# EAGLE design carte (EAGLE 7.2.0)
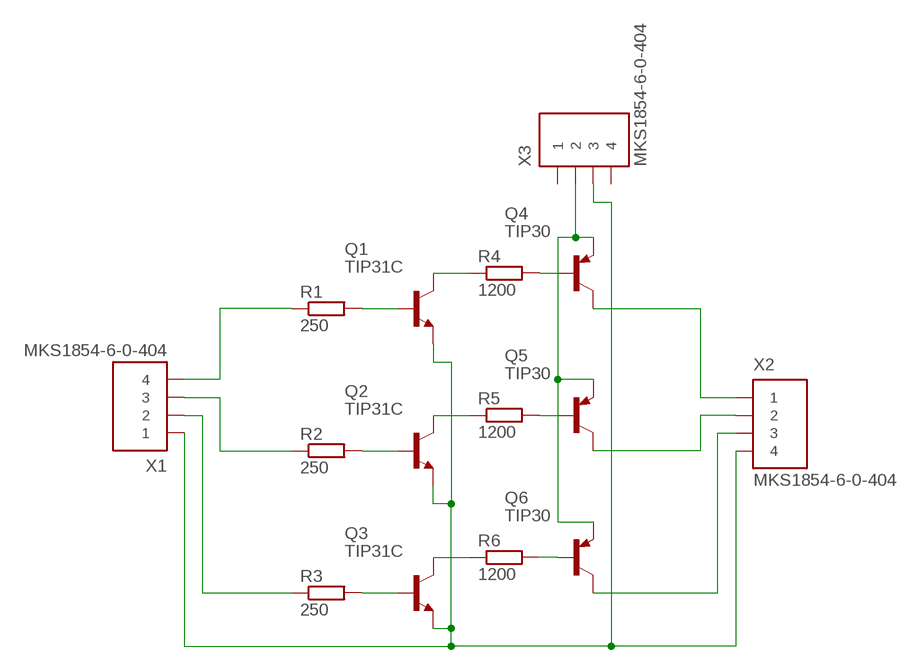
[diagram p0: schematic, sheet 1]

## Parts
Q1  TIP31C  [TO220]
Q2  TIP31C  [TO220]
Q3  TIP31C  [TO220]
Q4  TIP30  [TO220]
Q5  TIP30  [TO220]
Q6  TIP30  [TO220]
R1  250  R-EU_0207/10  [0207/10]
R2  250  R-EU_0207/10  [0207/10]
R3  250  R-EU_0207/10  [0207/10]
R4  1200  R-EU_0207/10  [0207/10]
R5  1200  R-EU_0207/10  [0207/10]
R6  1200  R-EU_0207/10  [0207/10]
X1  MKS1854-6-0-404  [MKS1854-6-0-404]
X2  MKS1854-6-0-404  [MKS1854-6-0-404]
X3  MKS1854-6-0-404  [MKS1854-6-0-404]

## Nets
N$1: Q1.1(B) R1.2
N$2: Q2.1(B) R2.2
N$3: Q3.1(B) R3.2
N$4: Q1.2(C) R4.1
N$5: Q2.2(C) R5.1
N$6: Q3.2(C) R6.1
N$7: Q4.1(B) R4.2
N$8: Q5.1(B) R5.2
N$9: Q6.1(B) R6.2
N$10: Q1.3(E) Q2.3(E) Q3.3(E) X1.1 X2.4 X3.3
N$12: R1.1 X1.4
N$13: R2.1 X1.3
N$14: R3.1 X1.2
N$15: Q4.3(E) Q5.3(E) Q6.3(E) X3.2
N$16: Q4.2(C) X2.1
N$17: Q5.2(C) X2.2
N$18: Q6.2(C) X2.3
Unconnected: X3.1 X3.4

## Library data of the parts
Q1-Q3 = transistor-npn:TIP31C*: NPN Transistor
Q4-Q6 = transistor-pnp:TIP30: PNP Transistor
R1-R6 = resistor:R-EU_: RESISTOR, European symbol
X1-X3 = con-stocko:MKS1854-6-0-404: Serie MKS 1850 Lötstifte In-line, Raster 2.5 mm, Stiftwannen, stehend, mit Rastlasche Source: http://www.stocko.de/de/index.php?seite=ka_rfk2_mks1850.html&rubrik=Katalog+-+RFK+2 rfk_1850.pdf; OC_FARNELL: 1141862; OC_NEWARK: unknown

## Net classes
0 default: width 0.025 mm

## Board
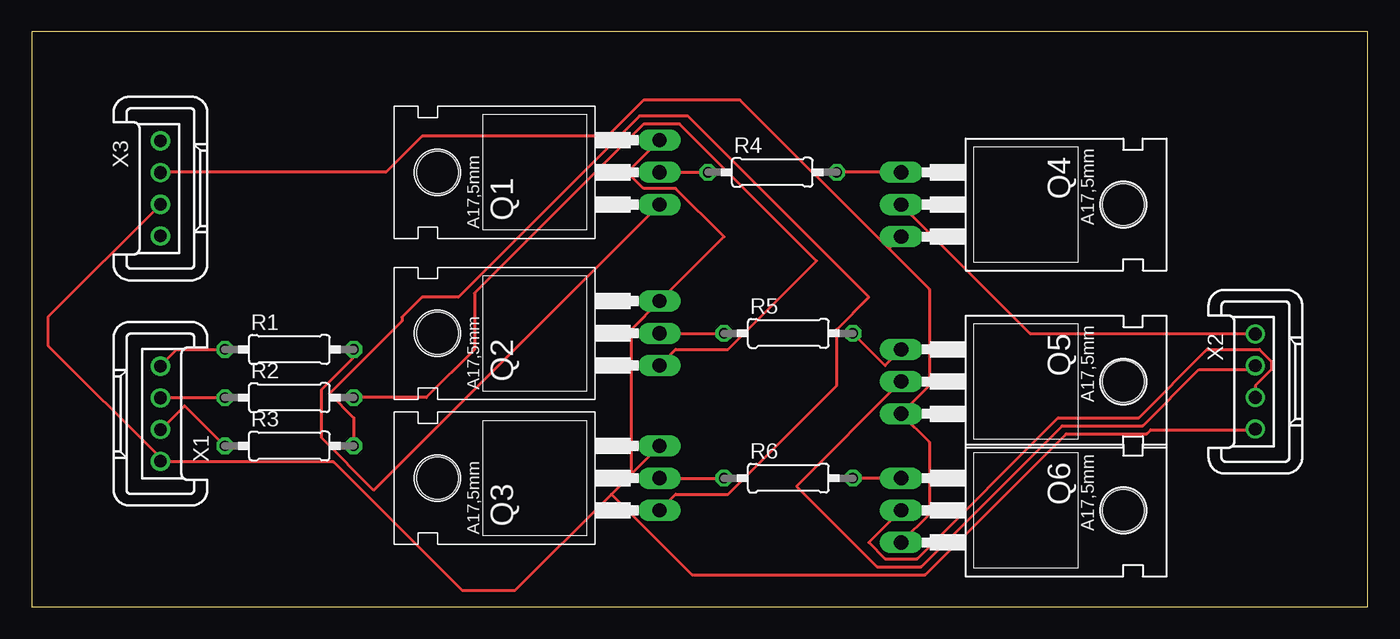
[diagram p1: board, top side]

Size 105.39 x 45.39 mm. Coordinates in mm from the lower left corner, seen from the top.
Outline: 0,0 105.39,0 105.39,45.39 0,45.39 0,0
Copper layers (1*16): Top 0.035mm / dielectric 1.5mm / Bottom 0.035mm
Design rules "default": minimum track width 10mil, minimum drill 24mil, track to track 8mil, track to pad 8mil, pad to pad 8mil, via to via 8mil, smd to smd 8mil, copper to edge 40mil, drill to drill 8mil, minimum pad ring 10mil, minimum via ring 8mil, stop-mask expansion 4mil, vias tented up to drill 0mil, thermal gap 10mil

### Footprints (pad centres in the part's own frame; a part is rotated, then mirrored left to right if it is on the bottom)
TO220 = drill 1.118 long: 1 -2.54,-6.35; 2 0,-6.35; 3 2.54,-6.35 | hole 3.302: 0,11.176
0207/10 = drill 0.813 octagon: 1 -5.08,0; 2 5.08,0
MKS1854-6-0-404 = drill 1 pad 1.422: 1 -3.75,0; 2 -1.25,0; 3 1.25,0; 4 3.75,0

### Placement (x,y rotation side)
Q1  43.18,34.29 90 top
Q2  43.18,21.59 90 top
Q3  43.18,10.16 90 top
Q4  74.93,31.75 270 top
Q5  74.93,17.78 270 top
Q6  74.93,7.62 270 top
R1  20.32,20.32 0 top
R2  20.32,16.51 0 top
R3  20.32,12.7 0 top
R4  58.42,34.29 0 top
R5  59.69,21.59 0 top
R6  59.69,10.16 0 top
X1  10.16,15.24 90 top
X2  96.52,17.78 270 top
X3  10.16,33.02 270 top

### Tracks (layer width: path | path; a pad name or v marks a point on that pad's centre or on a via)
N$1
  Top 0.254: R1.2 25.4,19.69 22.86,17.15 22.86,13.34 26.99,9.21 Q1.1
N$2
  Top 0.254: R2.2 31.11,16.51 34.92,20.32 34.92,24.77 48.26,38.1 51.12,38.1 61.91,27.3 54.93,20.32 50.8,20.32 Q2.1
N$3
  Top 0.254: R3.2 25.4,14.92 23.49,16.83 29.21,22.54 29.21,22.86 30.8,24.45 33.66,24.45 47.94,38.74 51.75,38.74 66.04,24.45 63.5,21.91 63.5,17.46 54.93,8.89 50.8,8.89 Q3.1
N$4
  Top 0.254: Q1.2 R4.1
N$5
  Top 0.254: Q2.2 R5.1
N$6
  Top 0.254: Q3.2 R6.1
N$7
  Top 0.254: Q4.1 R4.2
N$8
  Top 0.254: R5.2 67.31,19.05 Q5.1
N$9
  Top 0.254: Q6.1 R6.2
N$10
  Top 0.254: X3.3 10.16,31.75 1.27,22.86 1.27,20.64 10.16,11.75 X1.1 10.16,11.43 23.81,11.43 33.97,1.27 38.1,1.27 45.72,8.89 | 45.72,8.89 52.07,2.54 70.48,2.54 81.6,13.65 87.95,13.65 88.27,13.97 96.52,13.97 X2.4 | Q3.3 47.31,10.48 | 47.31,10.48 45.72,8.89 | 47.31,10.48 47.31,21.91 Q2.3 54.61,29.21 50.8,33.02 48.26,33.02 47.31,33.97 47.31,34.61 Q1.3
N$12
  Top 0.254: R1.1 11.43,20.32 10.16,19.05 X1.4
N$13
  Top 0.254: R2.1 10.16,16.51 X1.3
N$14
  Top 0.254: R3.1 12.07,15.88 10.16,13.97 X1.2
N$15
  Top 0.254: Q6.3 70.8,7.3 70.8,13.02 Q5.3 70.8,17.46 70.8,25.08 67.63,28.26 | 67.63,28.26 55.88,40.01 48.26,40.01 45.4,37.15 30.8,37.15 27.94,34.29 10.16,34.29 X3.2 | Q4.3 67.63,28.26
N$16
  Top 0.254: Q4.2 78.74,21.59 96.52,21.59 X2.1
N$17
  Top 0.254: Q5.2 60.32,9.52 66.68,3.18 70.17,3.18 81.28,14.29 87.63,14.29 92.08,18.73 96.52,18.73 X2.2
N$18
  Top 0.254: X2.3 96.52,17.46 97.79,18.73 97.79,19.37 96.84,20.32 92.71,20.32 87.31,14.92 80.96,14.92 69.85,3.81 67.31,3.81 66.04,5.08 Q6.2